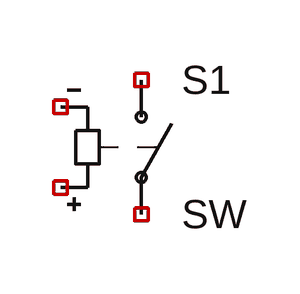
[diagram p0: schematic Draft1.asc]
Draft1.asc, the LTspice schematic file:
Version 4
SHEET 1 880 680
SYMBOL sw 96 64 R0
SYMATTR InstName S1

The netlist it stands for:
* Draft1.asc
S1 NC_01 NC_02 NC_03 NC_04 SW
.backanno
.end